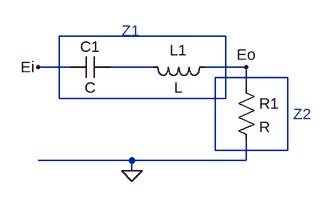
[diagram p0: schematic Draft2.asc]
Draft2.asc, the LTspice schematic file:
Version 4
SHEET 1 880 680
WIRE 112 32 -144 32
WIRE -128 80 -176 80
WIRE 0 80 -64 80
WIRE 144 80 80 80
WIRE 208 96 96 96
WIRE 144 112 144 80
WIRE -144 128 -144 32
WIRE 112 128 112 32
WIRE 112 128 -144 128
WIRE 96 208 96 96
WIRE 208 208 208 96
WIRE 208 208 96 208
WIRE -32 224 -176 224
WIRE 144 224 144 192
WIRE 144 224 -32 224
WIRE -32 240 -32 224
FLAG -32 240 0
FLAG 144 80 Eo
FLAG -176 80 Ei
SYMBOL res 128 96 R0
SYMATTR InstName R1
SYMBOL ind 96 64 R90
WINDOW 0 5 56 VBottom 2
WINDOW 3 32 56 VTop 2
SYMATTR InstName L1
SYMBOL cap -64 64 R90
WINDOW 0 0 32 VBottom 2
WINDOW 3 32 32 VTop 2
SYMATTR InstName C1
TEXT -48 24 Left 2 ;Z1
TEXT 216 152 Left 2 ;Z2

The netlist it stands for:
* Draft2.asc
R1 Eo 0 R
L1 Eo N002 L
C1 N002 Ei C
* Z1
* Z2
.backanno
.end